# EAGLE design Xbee Trigger Breakout (EAGLE 9.4.2)
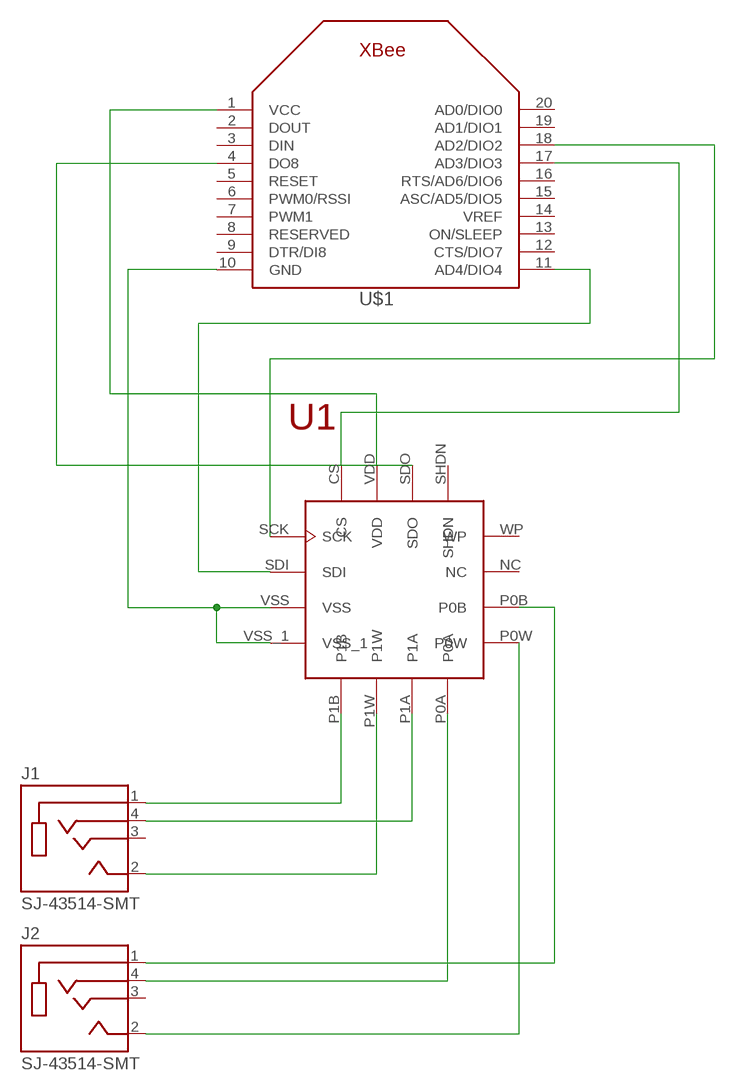
[diagram p0: schematic, sheet 1]

## Parts
J1  SJ-43514-SMT  [CUI_SJ-43514-SMT]
J2  SJ-43514-SMT  [CUI_SJ-43514-SMT]
U1  MCP4261  [2CH_DIGITAL_POT_QFN]
U$1  XBEE  [XBEE]

## Nets
GND: U1.VSS U1.VSS_1 U$1.10(GND)
N$1: J1.1(SLEEVE) U1.P1B
N$2: J1.4(RING2) U1.P1A
N$3: J1.2(TIP) U1.P1W
N$4: J2.4(RING2) U1.P0A
N$5: J2.1(SLEEVE) U1.P0B
N$6: J2.2(TIP) U1.P0W
N$9: U1.SCK U$1.18(AD2/DIO2)
N$10: U1.CS U$1.17(AD3/DIO3)
N$11: U1.SDO U$1.4(DO8)
N$12: U1.SDI U$1.11(AD4/DIO4)
VCC: U1.VDD U$1.1(VCC)
Unconnected: J1.3(RING1) J2.3(RING1) U1.NC U1.SHDN U1.WP U$1.2(DOUT) U$1.3(DIN) U$1.5(RESET) U$1.6(PWM0/RSSI) U$1.7(PWM1) U$1.8(RESERVED) U$1.9(DTR/DI8) U$1.12(CTS/DIO7) U$1.13(ON/SLEEP) U$1.14(VREF) U$1.15(ASC/AD5/DIO5) U$1.16(RTS/AD6/DIO6) U$1.19(AD1/DIO1) U$1.20(AD0/DIO0)

## Library data of the parts
J1 J2 = SJ-43514-SMT:SJ-43514-SMT: 4 conductor 3.5 mm Surface Mount Audio Jack; AVAILABILITY: Unavailable; DESCRIPTION: 4 conductor 3.5 mm Surface Mount Audio Jack; MF: CUI; MP: SJ-43514-SMT; PACKAGE: None; PRICE: 0.93 USD
U1 = mcp4261:MCP4261: MCP4261 - Two Channel Digital Potentiometer (10k) DigiKey: MCP4261-103E/ML-ND <https://www.digikey.com/product-detail/en/microchip-technology/MCP4261-103E-ML/MCP4261-103E-ML-ND/1874147>
U$1 = adafruit:XBEE

## Board
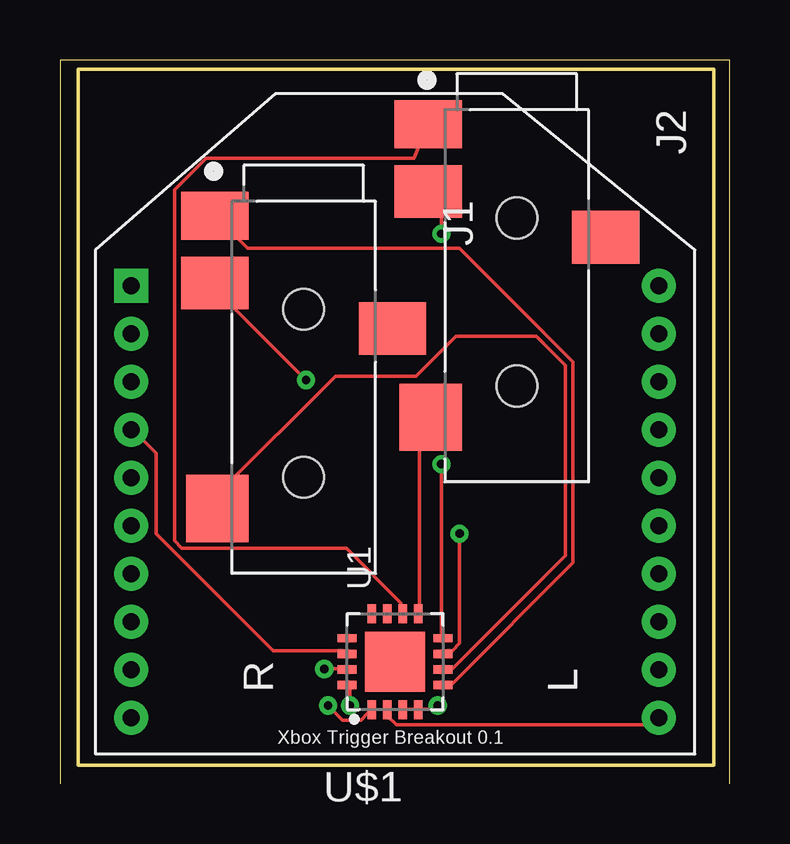
[diagram p1: board, top side]
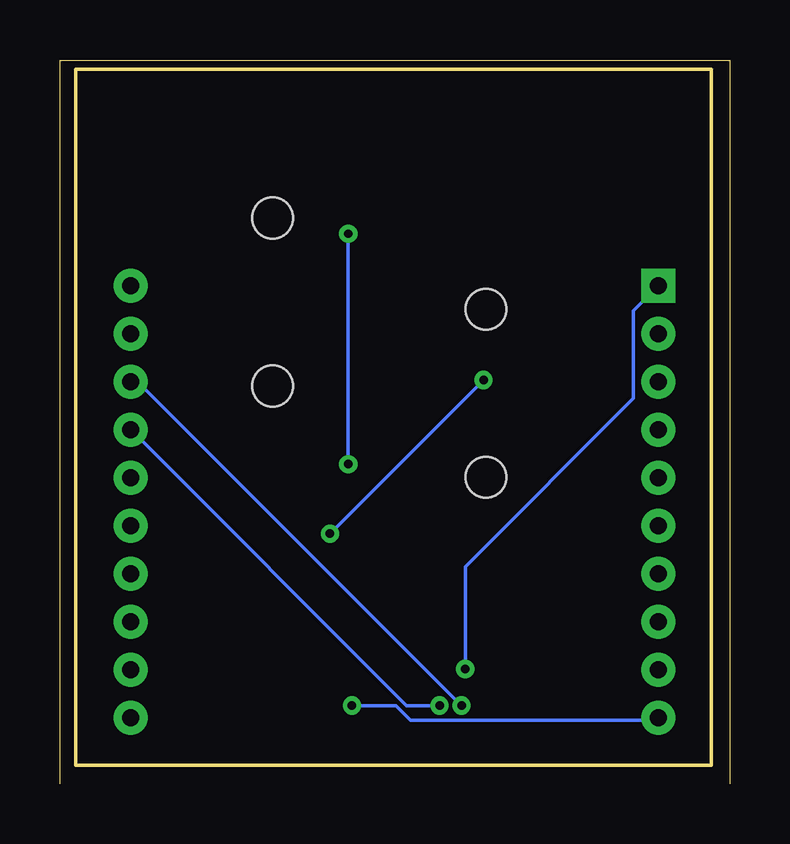
[diagram p2: board, bottom side, seen from below]

Size 27.92 x 30.15 mm. Coordinates in mm from the lower left corner, seen from the top.
Outline: 27.92,0 27.92,30.15 0,30.15 0,0
Outline: 0.77,0.77 0.77,29.77 27.27,29.77 27.27,0.77 0.77,0.77
Copper layers (1*16): Top 0.035mm / dielectric 1.5mm / Bottom 0.035mm
Design rules "default": minimum track width 6mil, minimum drill 0.35mm, track to track 6mil, track to pad 6mil, pad to pad 6mil, via to via 6mil, smd to smd 6mil, copper to edge 40mil, drill to drill 6mil, minimum pad ring 10mil, minimum via ring 8mil, stop-mask expansion 4mil, vias tented up to drill 0mil, thermal gap 10mil

### Footprints (pad centres in the part's own frame; a part is rotated, then mirrored left to right if it is on the bottom)
CUI_SJ-43514-SMT = smd 2 x 2.8: 1 -7.15,-3.7 | smd 2.8 x 2.6: 2 5.05,-3.6 | smd 2.2 x 2.8: 3 -2.45,3.7; 4 -4.35,-3.7 | hole 1.7: -3.25,0; 3.75,0
2CH_DIGITAL_POT_QFN = smd 0.35 x 0.8: CS -0.975,2; P0A 0.975,-2; P1A 0.325,-2; P1B -0.975,-2; P1W -0.325,-2; SDO 0.325,2; SHDN 0.975,2; VDD -0.325,2 | smd 2.5 x 2.5: EP 0,0 | smd 0.8 x 0.35: NC 2,0.325; P0B 2,-0.325; P0W 2,-0.975; SCK -2,0.975; SDI -2,0.325; VSS -2,-0.325; VSS_1 -2,-0.975; WP 2,0.975
XBEE = drill 0.7 pad 1.422 square: 1 -11,5.5 | drill 0.7 pad 1.422: 2 -11,3.5; 3 -11,1.5; 4 -11,-0.5; 5 -11,-2.5; 6 -11,-4.5; 7 -11,-6.5; 8 -11,-8.5; 9 -11,-10.5; 10 -11,-12.5; 11 11,-12.5; 12 11,-10.5; 13 11,-8.5; 14 11,-6.5; 15 11,-4.5; 16 11,-2.5; 17 11,-0.5; 18 11,1.5; 19 11,3.5; 20 11,5.5

### Placement (x,y rotation side)
J1  10.16,16.51 270 top
J2  19.05,20.32 270 top
U1  13.97,5.08 90 top
U$1  13.97,15.24 0 top

### Tracks (layer width: path | path; a pad name or v marks a point on that pad's centre or on a via)
GND  (via drill 0.35)
  Top 0.152: U1.VSS 14.38,3.1 14.83,3.1 U1.VSS_1 14.99,3.1 15.6,3.1 v15.75,3.25
  Bottom 0.152: v15.75,3.25 13.92,3.25 13.31,2.64 3.1,2.64 U$1.10
N$1
  Top 0.152: U1.P1B 16.05,4.17 16.36,4.17 21.39,9.2 21.39,17.58 16.66,22.3 7.82,22.3 6.6,23.52 J1.1
N$2  (via drill 0.35)
  Top 0.152: v16.66,10.41 16.66,5.84 16.36,5.54 16.05,5.54 U1.P1A | v10.26,16.82 6.6,20.47 6.6,20.78 J1.4
  Bottom 0.152: v10.26,16.82 v16.66,10.41
N$3
  Top 0.152: U1.P1W 16.05,4.78 16.36,4.78 21.08,9.5 21.08,17.42 19.86,18.64 16.51,18.64 14.83,16.97 11.48,16.97 6.6,12.09 6.6,11.48 J1.2
N$4  (via drill 0.35)
  Top 0.152: v15.9,13.31 15.9,6.15 U1.P0A | v15.9,22.91 15.9,24.13 15.44,24.59 J2.4
  Bottom 0.152: v15.9,22.91 v15.9,13.31
N$5
  Top 0.152: U1.P0B 14.22,7.21 14.22,7.52 11.94,9.8 5.08,9.8 4.78,10.11 4.78,24.74 6.1,26.06 14.75,26.06 J2.1
N$6
  Top 0.152: U1.P0W 14.99,7.21 14.99,14.68 15.44,15.14 J2.2
N$9  (via drill 0.35)
  Top 0.152: v11.18,3.25 11.79,2.64 12.55,2.64 12.85,2.95 U1.SCK
  Bottom 0.152: v11.18,3.25 24.59,16.66 24.89,16.66 U$1.18
N$10  (via drill 0.35)
  Top 0.152: v12.09,3.25 12.09,4.01 U1.CS
  Bottom 0.152: v12.09,3.25 13.46,3.25 24.89,14.68 U$1.17
N$11
  Top 0.152: U1.SDO 11.94,5.54 8.89,5.54 4.01,10.41 4.01,13.77 3.1,14.68 U$1.4
N$12
  Top 0.152: U$1.11 24.68,2.45 14.03,2.45 13.64,2.83 U1.SDI
VCC  (via drill 0.35)
  Top 0.152: v11.02,4.78 11.94,4.78 U1.VDD
  Bottom 0.152: v11.02,4.78 11.02,9.04 4.01,16.05 4.01,19.71 3.1,20.62 U$1.1

### Text on the board
tPlace: R | L | Xbox Trigger Breakout 0.1